# EAGLE schematic SOSI_Spooler (EAGLE 6.5.0)
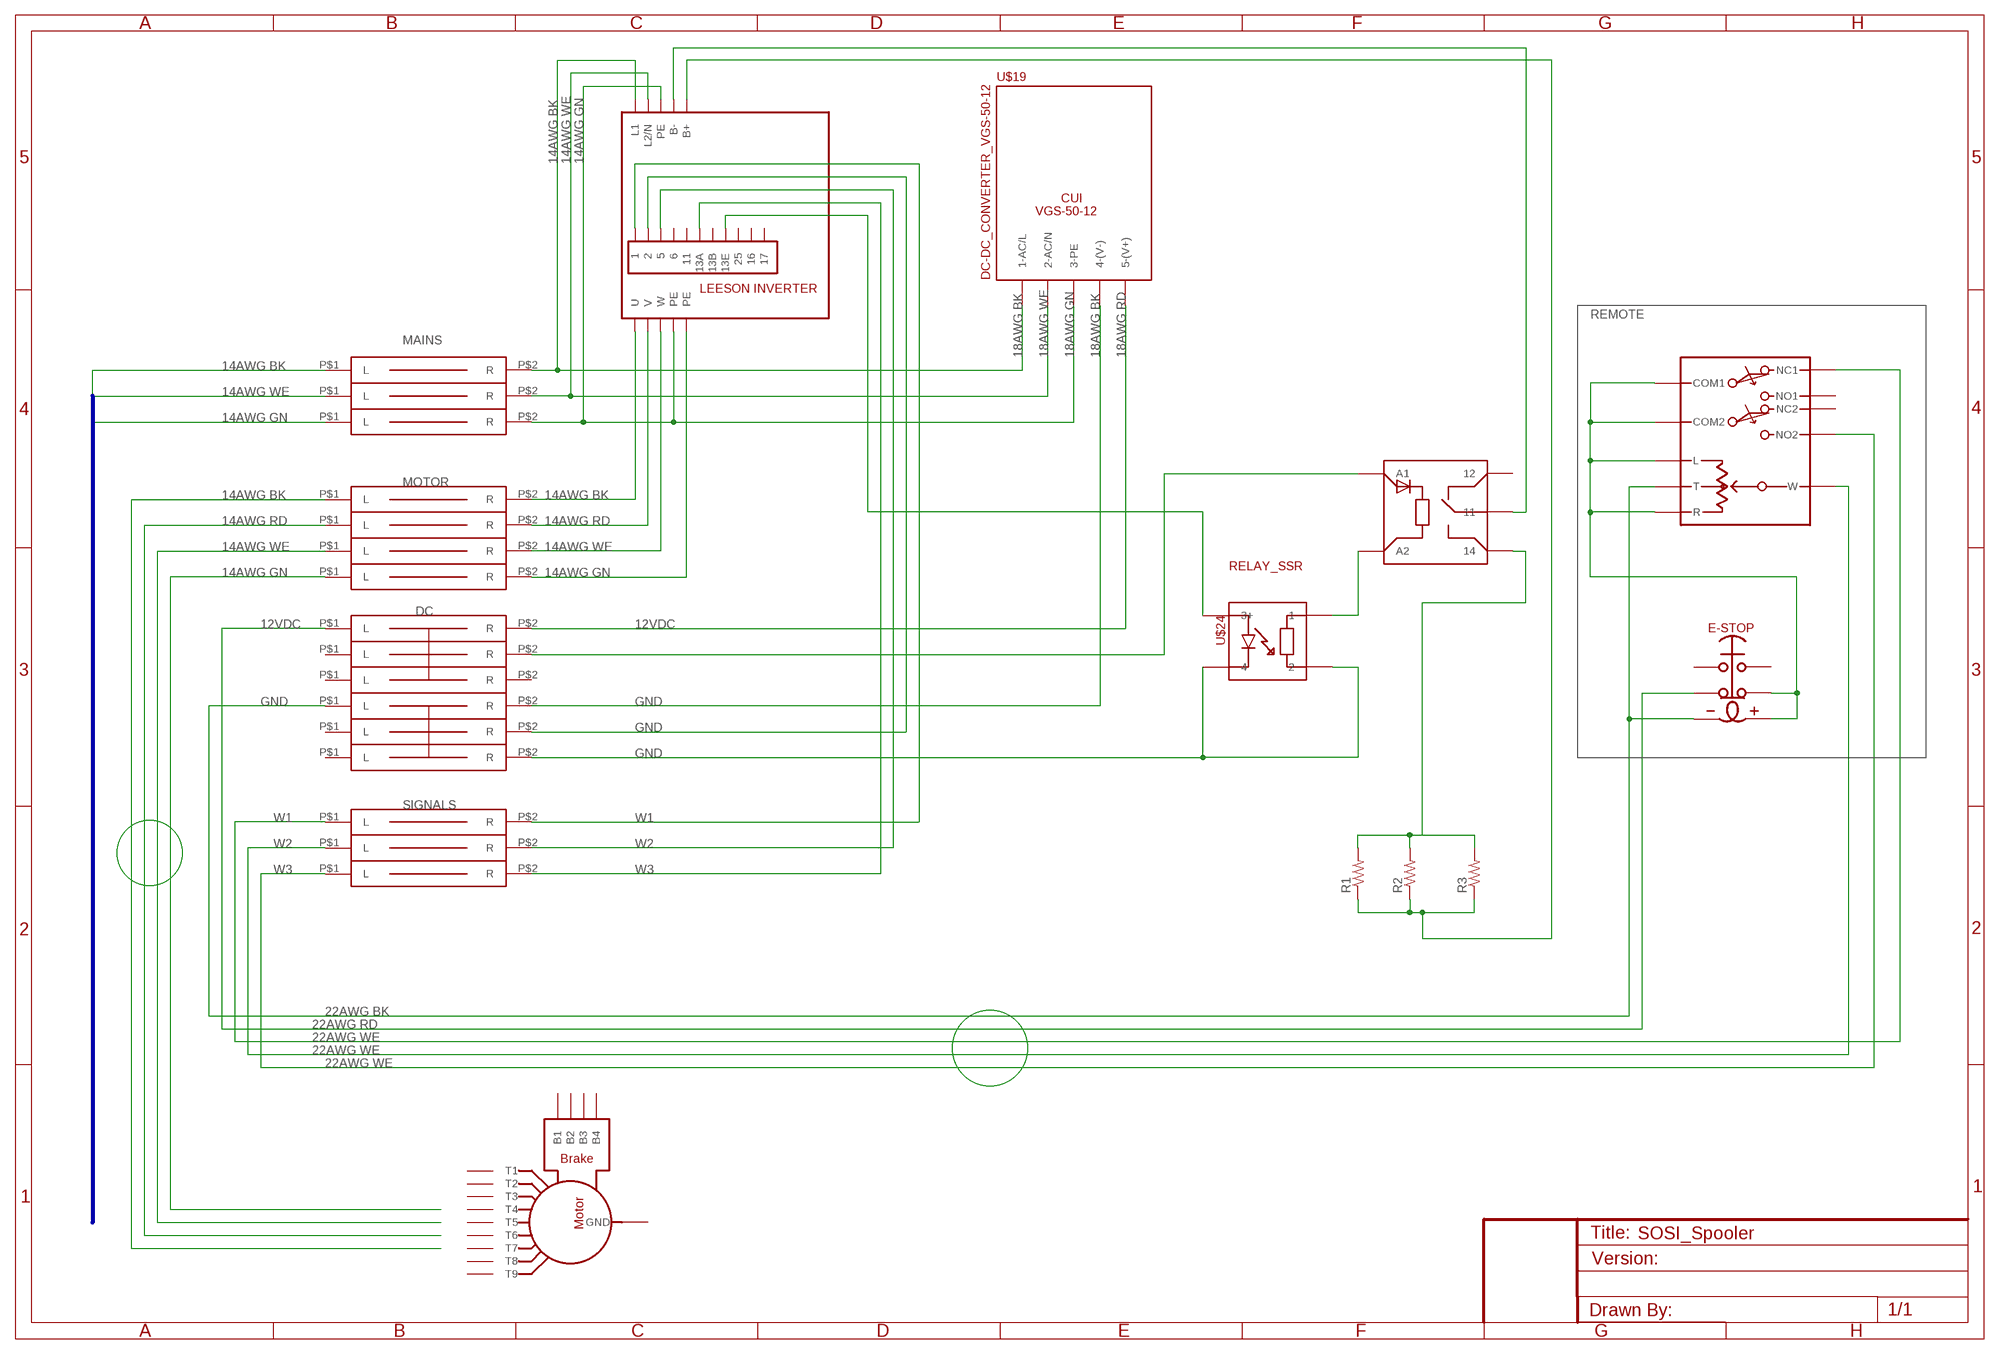
[diagram p0: schematic, sheet 1]

## Parts
R1  R-US_0617/5V  [0617V]
R2  R-US_0617/5V  [0617V]
R3  R-US_0617/5V  [0617V]
U$1  LEESON_INVERTER  [BOGUS]
U$2  MOTOR_3PH  [BOGUS]
U$3  TB_ENTERLEC_SINGLE  [BOGUS]
U$4  TB_ENTERLEC_SINGLE  [BOGUS]
U$5  TB_ENTERLEC_SINGLE  [BOGUS]
U$6  TB_ENTERLEC_SINGLE  [BOGUS]
U$7  TB_ENTERLEC_SINGLE  [BOGUS]
U$8  TB_ENTERLEC_SINGLE  [BOGUS]
U$9  TB_ENTERLEC_SINGLE  [BOGUS]
U$10  TB_ENTERLEC_SINGLE  [BOGUS]
U$11  TB_ENTERLEC_SINGLE  [BOGUS]
U$12  TB_ENTERLEC_SINGLE  [BOGUS]
U$13  TB_ENTERLEC_SINGLE  [BOGUS]
U$14  TB_ENTERLEC_SINGLE  [BOGUS]
U$15  TB_ENTERLEC_SINGLE  [BOGUS]
U$16  RELAY_TB  [BOGUS]
U$17  TB_ENTERLEC_SINGLE  [BOGUS]
U$18  TB_ENTERLEC_SINGLE  [BOGUS]
U$19  DC-DC_CONVERTER_VGS-50-12  [BOGUS]
U$20  TB_ENTERLEC_SINGLE  [BOGUS]
U$21  SWITCH_ESTOP_LIGHTED  [BOGUS]
U$22  JOYSTICK_PRO-5  [BOGUS]
U$24  RELAY_SSR  [BOGUS]

## Nets
B$1: U$12.P$1(L) U$13.P$1(L) U$14.P$1(L)
B$2: U$3.P$1(L) U$4.P$1(L) U$5.P$1(L)
N$1: U$1.P$14(L1) U$14.P$2(R) U$19.P$1(1-AC/L)
N$2: U$1.P$15(L2/N) U$13.P$2(R) U$19.P$2(2-AC/N)
N$3: U$1.P$16(PE) U$1.P$17(PE) U$12.P$2(R) U$19.P$3(3-PE)
N$4: U$6.P$2(R) U$19.P$5(5-(V+))
N$5: U$9.P$2(R) U$19.P$4(4-(V-))
N$6: U$1.P$21(U) U$3.P$2(R)
N$7: U$1.P$20(V) U$4.P$2(R)
N$8: U$1.P$19(W) U$5.P$2(R)
N$9: U$1.P$18(PE) U$20.P$2(R)
N$10: U$1.P$1 U$15.P$2(R)
N$11: U$1.P$2 U$10.P$2(R)
N$12: U$1.P$3 U$17.P$2(R)
N$13: U$1.P$6(13A) U$18.P$2(R)
N$14: U$1.P$8(13E) U$24.P$3(3+)
N$15: U$11.P$2(R) U$24.P$2 U$24.P$4
N$16: U$6.P$1(L) U$21.P$4
N$17: U$15.P$1(L) U$22.P$4(NC1)
N$18: U$17.P$1(L) U$22.P$10(W)
N$19: U$18.P$1(L) U$22.P$7(NO2)
N$20: U$16.P$5(A2) U$24.P$1
N$21: U$20.P$1(L)
N$22: U$9.P$1(L) U$21.P$6 U$22.P$9(T)
N$23: U$7.P$2(R) U$16.P$4(A1)
N$24: U$1.P$13(B-) U$16.P$1
N$26: U$21.P$2 U$21.P$5 U$22.P$1(COM1) U$22.P$2(COM2) U$22.P$3(L) U$22.P$8(R)
N$28: R1.2 R2.2 R3.2 U$16.P$3
N$29: R1.1 R2.1 R3.1 U$1.P$12(B+)
Unconnected: U$1.P$4 U$1.P$5 U$1.P$7(13B) U$1.P$9 U$1.P$10 U$1.P$11 U$2.P$1(B1) U$2.P$2(B2) U$2.P$3(B3) U$2.P$4(B4) U$2.P$5(T1) U$2.P$6(T2) U$2.P$7(T3) U$2.P$8(T4) U$2.P$9(T5) U$2.P$10(T6) U$2.P$11(T7) U$2.P$12(T8) U$2.P$13(T9) U$2.P$14(GND) U$7.P$1(L) U$8.P$1(L) U$8.P$2(R) U$10.P$1(L) U$11.P$1(L) U$16.P$2 U$21.P$1 U$21.P$3 U$22.P$5(NC2) U$22.P$6(NO1)

## Buses
B$1

## Notes on the sheet
- 14AWG BK | 14AWG WE | 14AWG GN
- REMOTE
- MAINS
- 18AWG BK | 18AWG WE | 18AWG GN | 18AWG BK | 18AWG RD
- 14AWG BK
- 14AWG WE
- 14AWG GN
- MOTOR
- 14AWG BK | 14AWG BK
- 14AWG RD | 14AWG RD
- 14AWG WE | 14AWG WE
- 14AWG GN | 14AWG GN
- DC
- 12VDC | 12VDC
- GND | GND
- GND
- GND
- SIGNALS
- W1 | W1
- W2 | W2
- W3 | W3
- 22AWG BK
- 22AWG RD
- 22AWG WE
- 22AWG WE
- 22AWG WE

## Library data of the parts
R1-R3 = resistor:R-US_: RESISTOR, American symbol
U$1 = SOSI-Wiring-Diagram.rpt:LEESON_INVERTER: 9260-0001 174265 Motor control, adjustable speed, 1HP, 110VAC single phase input, 220VAC 3 phase output 9260-0002 174270 Motor control, adjustable speed, 1HP, 220VAC single phase input, 220VAC 3 phase output 9260-0006 174278 Inverter, SM Series, 2HP, 208/240 VAC, 3-Phase 9260-0007 174279 Inverter, SM Series, 3HP, 208/240 VAC, 3-Phase 9260-0008 174280 Inverter, SM Series, 7.5HP, 208/240 VAC, 3-Phase 9260-0016 174432 Inverter, SM Series, 20HP, 400-480V, 3-Phase 9260-0017 174282 Inverter, SM Series, 1HP, 400-480V, 3-Phase 9260-0021 174273 Inverter, SM Series, 3HP, 208/240 VAC, 1 phase 9260-0022 174272 Inverter, SM Series, 2HP, 208/240 VAC, 1 phase Leeson Allied Electronics McGuire Bearing
U$2 = SOSI-Wiring-Diagram.rpt:MOTOR_3PH: 9500-0000 113020 Electric motor, washdown, 1HP, 208-230/460VAC, 3 phase, 1725 RPM, 56C mounting 9500-0005 G120762 Electric Motor, Washdown, 2HP, 208-230/460V, 60Hz, Cont., 1800 RPM, TEFC, 145TC 9500-0007 CEWDBM3611T BrakeMotor, Electric, Washdown, 3HP, 208-230/460V, 1760RPM, 3 Ph., 60Hz, 182TC, TEFC 9500-0009 G140467.00 Electric Motor, Washdown, 7.5HP, 220 VAC, 50-60 Hz, 3 Phase, 213TC Frame, No Base Leeson Kaman Industrial Technologies McGuire Bearing
U$3-U$15 U$17 U$18 U$20 = SOSI-TerminalBlocks:TB_ENTERLEC_SINGLE
U$16 = SOSI-Wiring-Diagram.rpt:RELAY_TB
U$19 = SOSI-Wiring-Diagram.rpt:DC-DC_CONVERTER_VGS-50-12
U$21 = DougM-SOSI-Wiring-Diagram.rpt:SWITCH_ESTOP_LIGHTED: 9210-0045 Switch, Emergency Stop, w/ #800T-XA4 contact block (old #800H-FRXTQH10RA4) Allen Bradley 800H-FRXTQH2RA4
U$22 = SOSI-Wiring-Diagram.rpt:JOYSTICK_PRO-5: 9280-0000 PRO5-202.1085 (w/20k center tap potentiometer) Joystick (Master Switch), w/20k center tap potentiometer J. R. Merritt Controls
U$24 = SOSI-Wiring-Diagram.rpt:RELAY_SSR